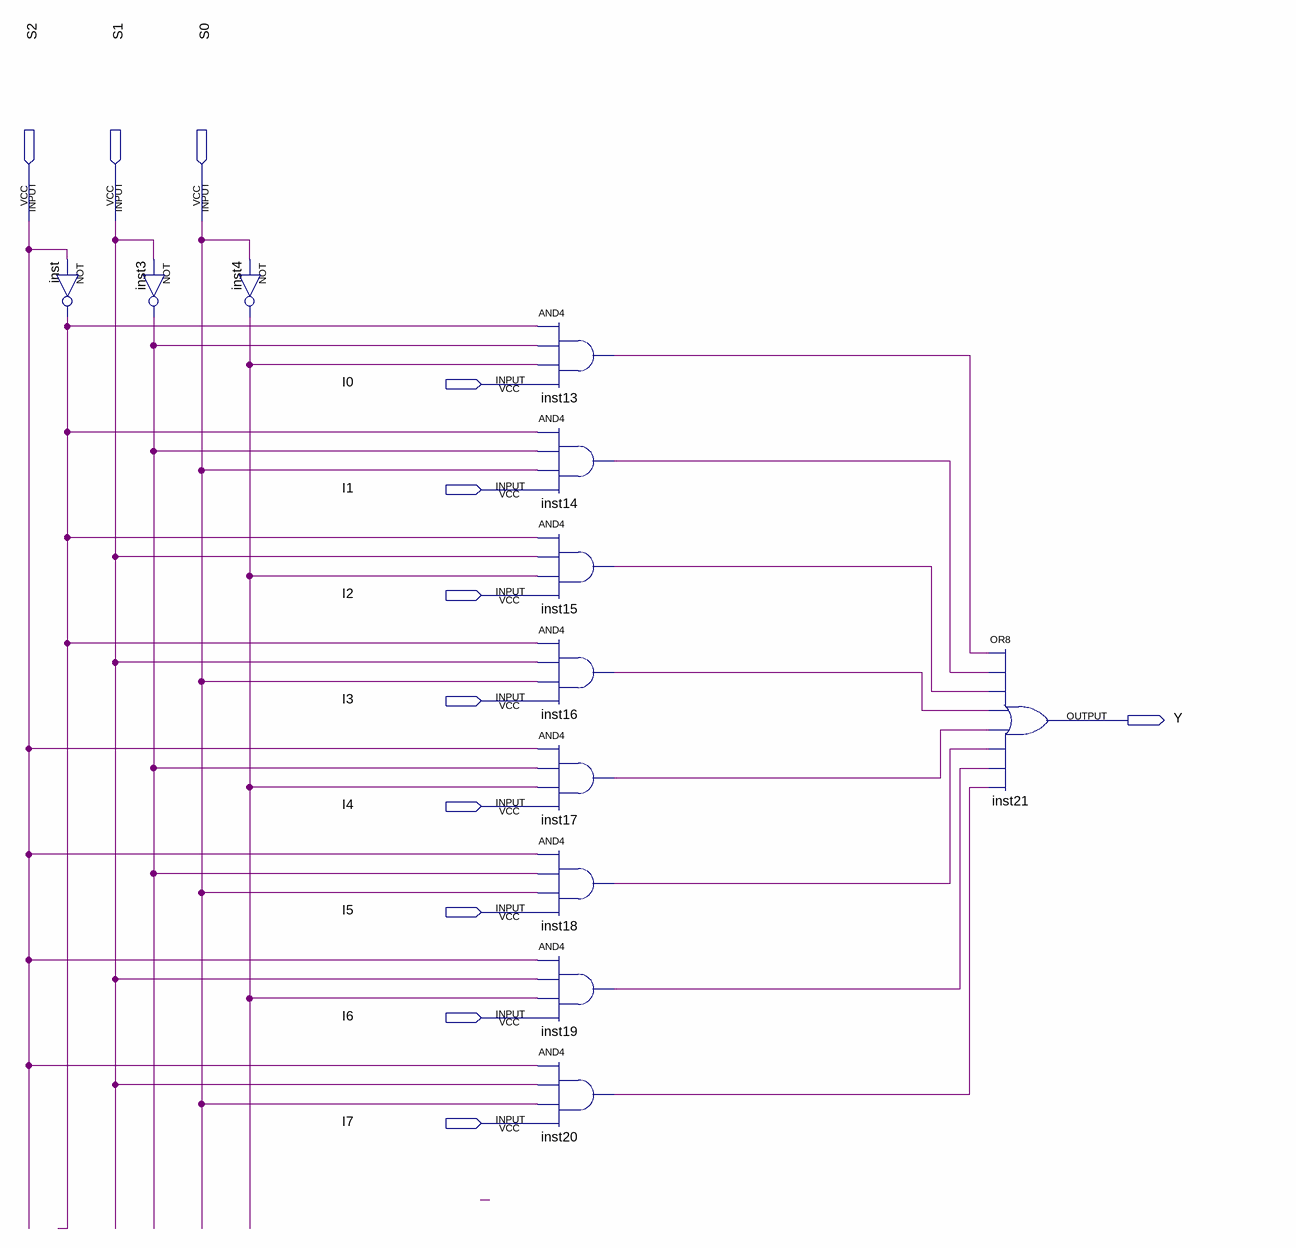
[diagram p0: schematic sheet]
// Quartus schematic 8to1mux.bdf as structural Verilog: 12 symbols, 12 pins
module \8to1mux  (
  input  S2,
  input  S1,
  input  S0,
  input  I0,
  input  I1,
  input  I2,
  input  I3,
  input  I4,
  input  I5,
  input  I6,
  input  I7,
  output Y
);

  wire inst3_out, inst4_out, inst13_out, inst14_out, inst15_out, inst16_out, inst17_out, inst18_out,
       inst19_out, inst20_out, inst_out;

  not inst (inst_out, S2);
  not inst3 (inst3_out, S1);
  not inst4 (inst4_out, S0);
  and inst13 (inst13_out, inst_out, inst3_out, inst4_out, I0);
  and inst14 (inst14_out, inst_out, inst3_out, S0, I1);
  and inst15 (inst15_out, inst_out, S1, inst4_out, I2);
  and inst16 (inst16_out, inst_out, S1, S0, I3);
  and inst17 (inst17_out, S2, inst3_out, inst4_out, I4);
  and inst18 (inst18_out, S2, inst3_out, S0, I5);
  and inst19 (inst19_out, S2, S1, inst4_out, I6);
  and inst20 (inst20_out, S2, S1, S0, I7);
  or inst21 (Y, inst13_out, inst14_out, inst15_out, inst16_out, inst17_out, inst18_out, inst19_out, inst20_out);
endmodule
